# EAGLE design C12_1_0 (EAGLE 8.3.2)
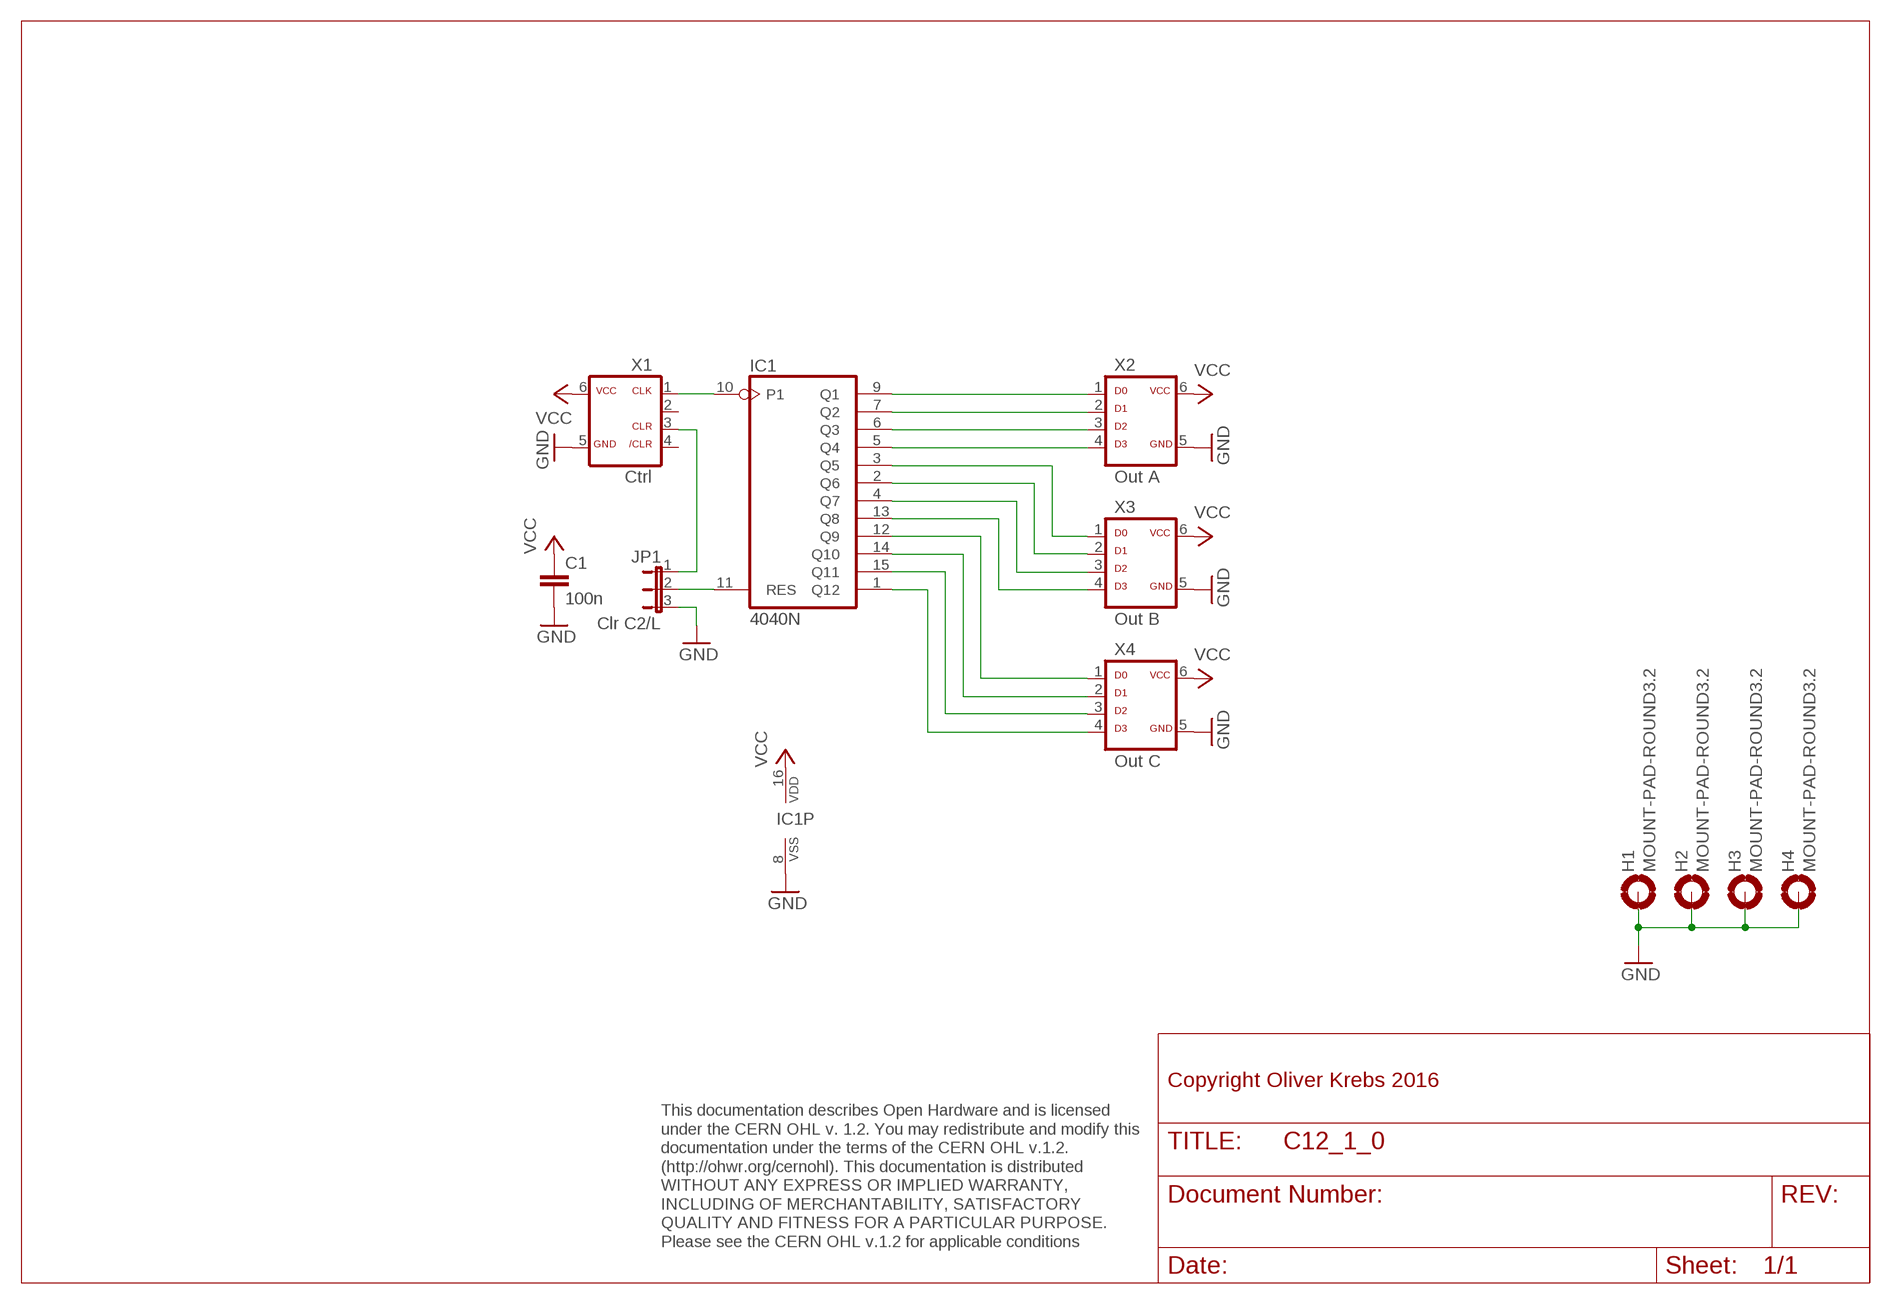
[diagram p0: schematic, sheet 1]

## Parts
C1  100n  C-EU050-025X075  [C050-025X075]
H1  MOUNT-PAD-ROUND3.2  [3,2-PAD]
H2  MOUNT-PAD-ROUND3.2  [3,2-PAD]
H3  MOUNT-PAD-ROUND3.2  [3,2-PAD]
H4  MOUNT-PAD-ROUND3.2  [3,2-PAD]
IC1  4040N  [DIL16]
JP1  Clr C2/L  JP2E  [JP2]
X1  Ctrl  ML6C  [ML-6]
X2  Out A  ML6D  [ML-6]
X3  Out B  ML6D  [ML-6]
X4  Out C  ML6D  [ML-6]

## Nets
GND: C1.2 H1.B3,2(MOUNT) H2.B3,2(MOUNT) H3.B3,2(MOUNT) H4.B3,2(MOUNT) IC1.8(VSS) JP1.3 X1.5 X2.5 X3.5 X4.5
N$1: IC1.9(Q1) X2.1
N$2: IC1.7(Q2) X2.2
N$3: IC1.6(Q3) X2.3
N$4: IC1.5(Q4) X2.4
N$5: IC1.12(Q9) X4.1
N$6: IC1.14(Q10) X4.2
N$7: IC1.15(Q11) X4.3
N$8: IC1.1(Q12) X4.4
N$9: IC1.10(P1) X1.1
N$10: JP1.1 X1.3
N$11: IC1.11(RES) JP1.2
N$13: IC1.3(Q5) X3.1
N$15: IC1.2(Q6) X3.2
N$16: IC1.4(Q7) X3.3
N$17: IC1.13(Q8) X3.4
VCC: C1.1 IC1.16(VDD) X1.6 X2.6 X3.6 X4.6
Unconnected: X1.2 X1.4

## Notes on the sheet
- Copyright Oliver Krebs 2016
- This documentation describes Open Hardware and is licensed 
  under the CERN OHL v. 1.2. You may redistribute and modify this 
  documentation under the terms of the CERN OHL v.1.2. 
  (http://ohwr.org/cernohl). This documentation is distributed
  WITHOUT ANY EXPRESS OR IMPLIED WARRANTY, 
  INCLUDING OF MERCHANTABILITY, SATISFACTORY 
  QUALITY AND FITNESS FOR A PARTICULAR PURPOSE. 
  Please see the CERN OHL v.1.2 for applicable conditions

## Library data of the parts
C1 = 01-my_rcl:C-EU: CAPACITOR, European symbol
H1-H4 = holes:MOUNT-PAD-ROUND: MOUNTING PAD, round
IC1 = 40xx:4040: 12-stage binary/ripple COUNTER
JP1 = jumper:JP2E: JUMPER
X1 = 01-my-con:ML6C
X2-X4 = 01-my-con:ML6D

## Board
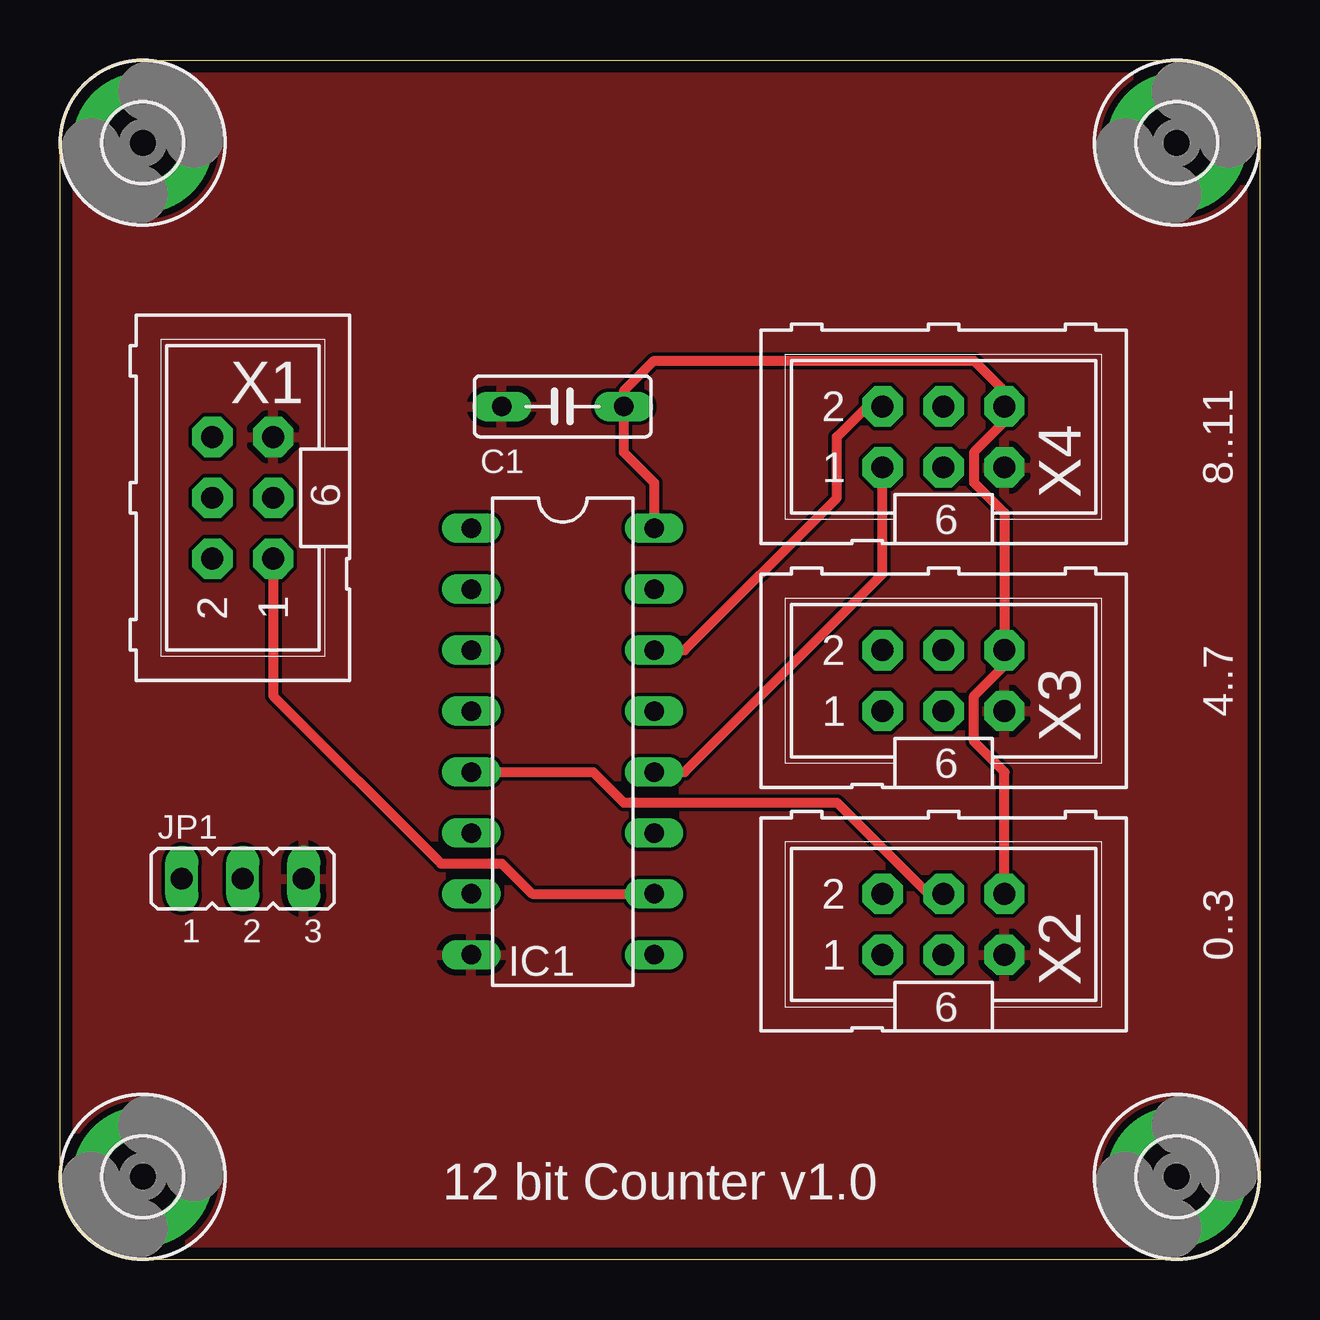
[diagram p1: board, top side]
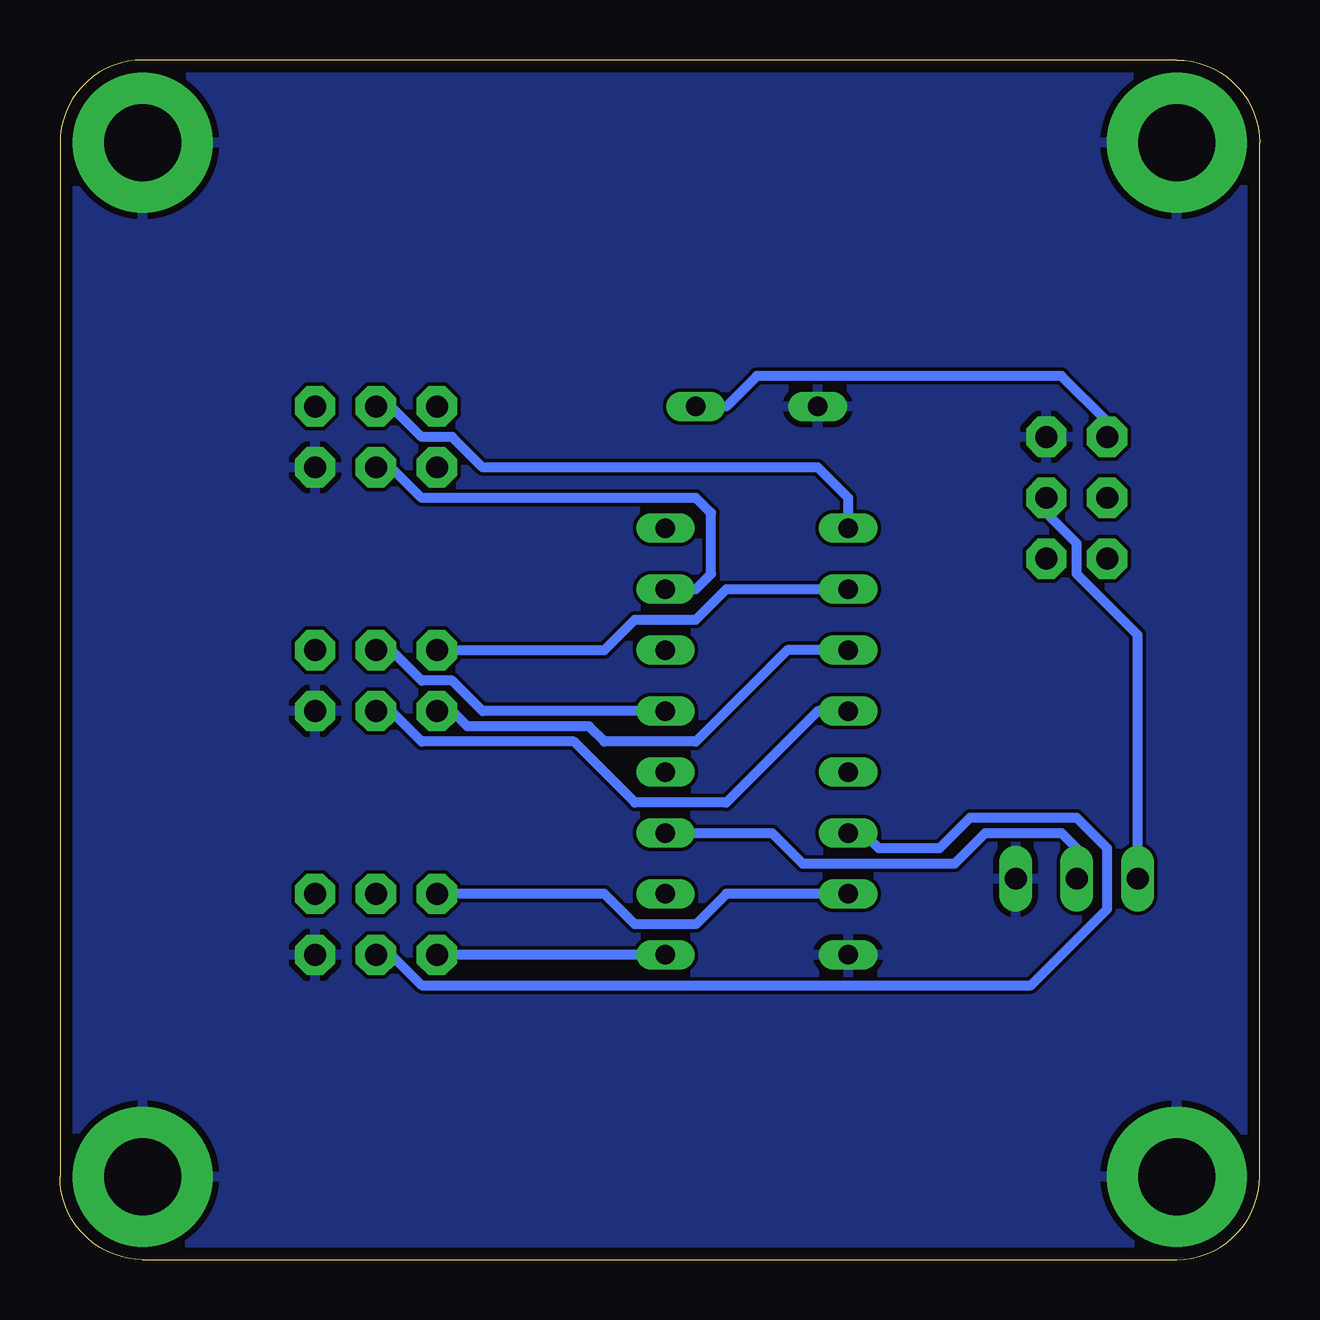
[diagram p2: board, bottom side, seen from below]

Size 50 x 50 mm. Coordinates in mm from the lower left corner, seen from the top.
Outline: 0,3.45 0,46.55 arc-90 3.45,50 46.55,50 arc-90 50,46.55 50,3.45 arc-90 46.55,0 3.45,0 arc-90 0,3.45
Copper layers (1*16): Top 0.035mm / dielectric 1.6mm / Bottom 0.035mm
Design rules "Elecrow_2-layer_PCB_eagle_rule": minimum track width 6mil, minimum drill 12mil, track to track 6mil, track to pad 6mil, pad to pad 6mil, via to via 8mil, smd to smd 0mil, copper to edge 20mil, drill to drill 10mil, minimum pad ring 6mil, minimum via ring 6mil, stop-mask expansion 0mil, vias tented up to drill 100mil, thermal gap 10mil

### Footprints (pad centres in the part's own frame; a part is rotated, then mirrored left to right if it is on the bottom)
C050-025X075 = drill 0.813 long: 1 -2.54,0; 2 2.54,0
3,2-PAD = drill 3.2 pad 5.842: B3,2 0,0
DIL16 = drill 0.813 long: 1 -8.89,-3.81; 2 -6.35,-3.81; 3 -3.81,-3.81; 4 -1.27,-3.81; 5 1.27,-3.81; 6 3.81,-3.81; 7 6.35,-3.81; 8 8.89,-3.81; 9 8.89,3.81; 10 6.35,3.81; 11 3.81,3.81; 12 1.27,3.81; 13 -1.27,3.81; 14 -3.81,3.81; 15 -6.35,3.81; 16 -8.89,3.81
JP2 = drill 0.914 long: 1 -2.54,0; 2 0,0; 3 2.54,0
ML-6 = drill 0.914 pad 1.676 octagon: 1 -2.54,-1.27; 2 -2.54,1.27; 3 0,-1.27; 4 0,1.27; 5 2.54,-1.27; 6 2.54,1.27

### Placement (x,y rotation side)
C1  20.95,35.56 180 top
H1  3.45,46.55 0 top
H2  3.45,3.45 0 top
H3  46.55,3.45 0 top
H4  46.55,46.55 0 top
IC1  20.95,21.59 270 top
JP1  7.62,15.88 0 top
X1  7.62,31.75 90 top
X2  36.83,13.97 0 top
X3  36.83,24.13 0 top
X4  36.83,34.29 0 top

### Tracks (layer width: path | path; a pad name or v marks a point on that pad's centre or on a via)
GND
  pour Bottom: 0,50.16 50.16,50.16 50.16,0 0,0
  pour Top: 0,50.16 50.16,50.16 50.16,0 0,0
N$1
  Bottom 0.406: IC1.9 X2.1
N$2
  Bottom 0.406: IC1.7 22.23,15.24 23.5,13.97 26.04,13.97 27.3,15.24 X2.2
N$3
  Bottom 0.406: X2.3 36.2,12.7 34.92,11.43 9.53,11.43 6.35,14.61 6.35,17.14 7.62,18.41 12.06,18.41 13.34,17.14 15.88,17.14 16.51,17.78 IC1.6
N$4
  Top 0.406: IC1.5 22.23,20.32 23.5,19.05 32.38,19.05 36.2,15.24 X2.4
N$5
  Top 0.406: IC1.12 26.04,20.32 34.29,28.57 X4.1
N$6
  Top 0.406: IC1.14 26.04,25.4 32.38,31.75 32.38,34.29 33.66,35.56 X4.2
N$7
  Bottom 0.406: IC1.15 23.5,27.94 22.86,28.57 22.86,31.11 23.5,31.75 34.92,31.75 36.2,33.02 X4.3
N$8
  Bottom 0.406: IC1.1 17.14,31.75 18.41,33.02 32.38,33.02 33.66,34.29 34.92,34.29 36.2,35.56 X4.4
N$9
  Top 0.406: X1.1 8.89,23.5 15.88,16.51 18.41,16.51 19.68,15.24 IC1.10
N$10
  Bottom 0.406: JP1.1 5.08,26.04 7.62,28.57 7.62,29.84 8.89,31.11 X1.3
N$11
  Bottom 0.406: IC1.11 20.32,17.78 19.05,16.51 12.7,16.51 11.43,17.78 8.26,17.78 7.62,17.14 JP1.2
N$13
  Bottom 0.406: IC1.3 19.68,25.4 23.5,21.59 27.3,21.59 27.94,22.23 33.02,22.23 33.66,22.86 X3.1
N$15
  Bottom 0.406: X3.2 27.3,25.4 26.04,26.67 23.5,26.67 22.23,27.94 IC1.2
N$16
  Bottom 0.406: X3.3 36.2,22.86 34.92,21.59 28.57,21.59 26.04,19.05 22.23,19.05 18.41,22.86 IC1.4
N$17
  Bottom 0.406: IC1.13 32.38,22.86 33.66,24.13 34.92,24.13 36.2,25.4 X3.4
VCC
  Top 0.406: IC1.16 24.77,32.38 23.5,33.66 C1.1 23.5,36.2 24.77,37.47 38.1,37.47 39.37,36.2 X4.6 39.37,34.92 38.1,33.66 38.1,32.38 39.37,31.11 X3.6 39.37,24.77 38.1,23.5 38.1,21.59 39.37,20.32 X2.6
  Bottom 0.406: X1.6 6.35,34.92 8.26,36.83 20.95,36.83 22.23,35.56 C1.1

### Text on the board
tNames: 8..11 | 4..7 | 0..3 | 12 bit Counter v1.0
200bmp: E:/Bilder/Elektronik/Modulion/Mexdulon/mexdulon_50x50_pcb.bmp